# Altium project FEU-102-1_part2.PrjPcb
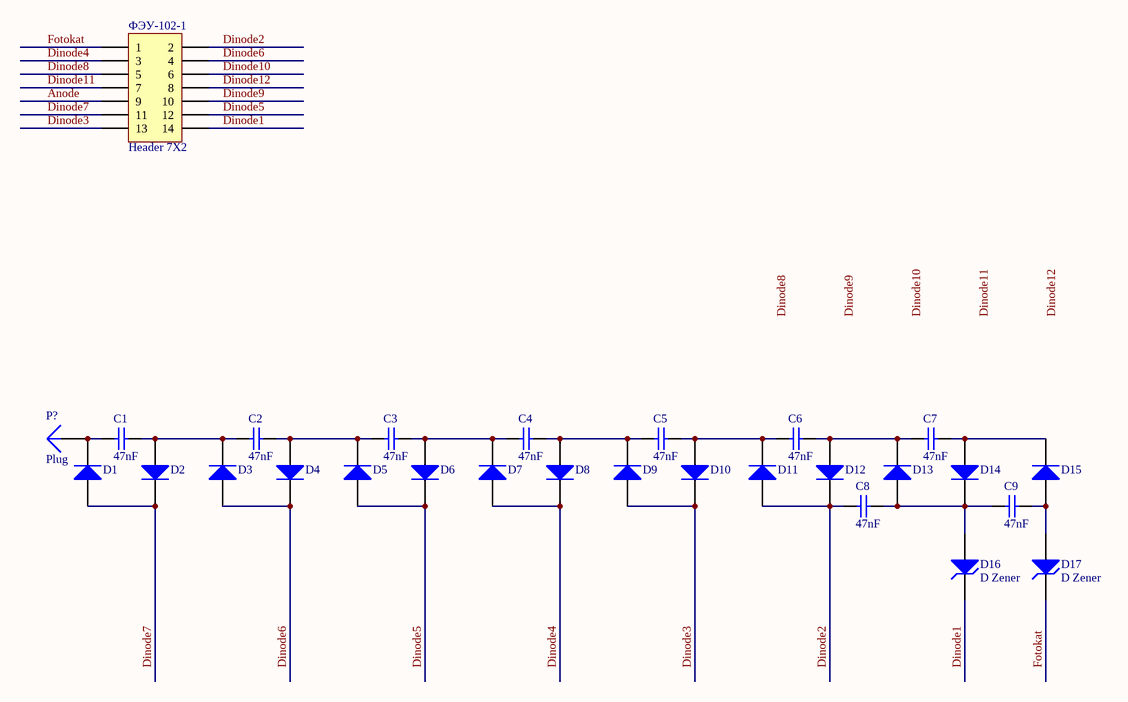
[diagram p0: FEU-102-1_part2.SchDoc]
1 sheet, 28 parts. Net scope: global (net labels, ports and power ports of the same name join across sheets).
Board file: FEU-102-1_part2.PcbDoc

## Sheet FEU-102-1_part2.SchDoc: Делитель ФЭУ-82
size A3; Address1: (с) Быканов Андрей; Address2: г.Тула 2016г.; Revision: 1

### Parts
C1  47nF  [0805_CAP]
C2  47nF  [0805_CAP]
C3  47nF  [0805_CAP]
C4  47nF  [0805_CAP]
C5  47nF  [0805_CAP]
C6  47nF  [0805_CAP]
C7  47nF  [0805_CAP]
C8  47nF  [0805_CAP]
C9  47nF  [0805_CAP]
D1  (no value)  [DA2JF8100L]
D2  (no value)  [DA2JF8100L]
D3  (no value)  [DA2JF8100L]
D4  (no value)  [DA2JF8100L]
D5  (no value)  [DA2JF8100L]
D6  (no value)  [DA2JF8100L]
D7  (no value)  [DA2JF8100L]
D8  (no value)  [DA2JF8100L]
D9  (no value)  [DA2JF8100L]
D10  (no value)  [DA2JF8100L]
D11  (no value)  [DA2JF8100L]
D12  (no value)  [DA2JF8100L]
D13  (no value)  [DA2JF8100L]
D14  (no value)  [DA2JF8100L]
D15  (no value)  [DA2JF8100L]
D16  D Zener  [BZX384]
D17  D Zener  [BZX384]
P?  Plug  [PIN1]
ФЭУ-102-1  Header 7X2  [ФЭУ-102]

### Nets
Anode: ФЭУ-102-1.9
Dinode1: D16.2(K) ФЭУ-102-1.14
Dinode2: C8.2 D11.1(A) D12.2(K) ФЭУ-102-1.2
Dinode3: D9.1(A) D10.2(K) ФЭУ-102-1.13
Dinode4: D7.1(A) D8.2(K) ФЭУ-102-1.3
Dinode5: D5.1(A) D6.2(K) ФЭУ-102-1.12
Dinode6: D3.1(A) D4.2(K) ФЭУ-102-1.4
Dinode7: D1.1(A) D2.2(K) ФЭУ-102-1.11
Dinode8: ФЭУ-102-1.5
Dinode9: ФЭУ-102-1.10
Dinode10: ФЭУ-102-1.6
Dinode11: ФЭУ-102-1.7
Dinode12: ФЭУ-102-1.8
Fotokat: D17.2(K) ФЭУ-102-1.1
NetC1_1: C1.1 C2.2 D2.1(A) D3.2(K)
NetC1_2: C1.2 D1.2(K) P?.1
NetC2_1: C2.1 C3.2 D4.1(A) D5.2(K)
NetC3_1: C3.1 C4.2 D6.1(A) D7.2(K)
NetC4_1: C4.1 C5.2 D8.1(A) D9.2(K)
NetC5_1: C5.1 C6.2 D10.1(A) D11.2(K)
NetC6_1: C6.1 C7.2 D12.1(A) D13.2(K)
NetC7_1: C7.1 D14.1(A) D15.2(K)
NetC8_1: C8.1 C9.2 D13.1(A) D14.2(K) D16.1(A)
NetC9_1: C9.1 D15.1(A) D17.1(A)

### Notes on the sheet
- Labels drawn without touching a wire or pin: Dinode8, Dinode9, Dinode10, Dinode11, Dinode12
- Title
- Size:
- Date:
- A3
- Number:
- Time:
- Revision:
- Sheet
- of
- File:

### Library data of the parts
C1-C9 = Cap Semi: Capacitor (Semiconductor SIM Model); Order: CGA4J4X7T2W473M/SOFT; Published: 8-Jun-2000; LatestRevisionDate: 29-May-2009; LatestRevisionNote: IPC-7351 Footprint Added.; PackageReference: C1206; Publisher: Altium Limited; PackageDescription: Chip Capacitor; Value: 47nF
D1-D15 = Diode: Default Diode; Value: DA2JF8100L; Published: 8-Jun-2000; LatestRevisionDate: 17-Jul-2002; LatestRevisionNote: Re-released for DXP Platform.; PackageVersion: Sep-1996; PackageReference: SMC; Publisher: Altium Limited; PackageDescription: DO-214-AB/SMC; 2 C-Bend Leads; Body 7.9 x 5.9 mm, inc. leads (LxW); Code_JEDEC: DO-214-AB; Order: DA2JF8100L
D16 D17 = D Zener: Zener Diode; Published: 8-Jun-2000; LatestRevisionDate: 17-Jul-2002; LatestRevisionNote: Re-released for DXP Platform.; PackageReference: DIODE-0.7; Publisher: Altium Limited; PackageDescription: Diode, Thru-Hole; 2 Leads; 0.7 in Pin Spacing
ФЭУ-102-1 = Header 7X2: Header, 7-Pin, Dual row; LatestRevisionDate: 17-Jul-2002; LatestRevisionNote: Re-released for DXP Platform.; Publisher: Altium Limited
P? = Plug: LatestRevisionDate: 17-Jul-2002; LatestRevisionNote: Re-released for DXP Platform.; Publisher: Altium Limited